# EAGLE design rpi2caster (EAGLE 7.3.0)
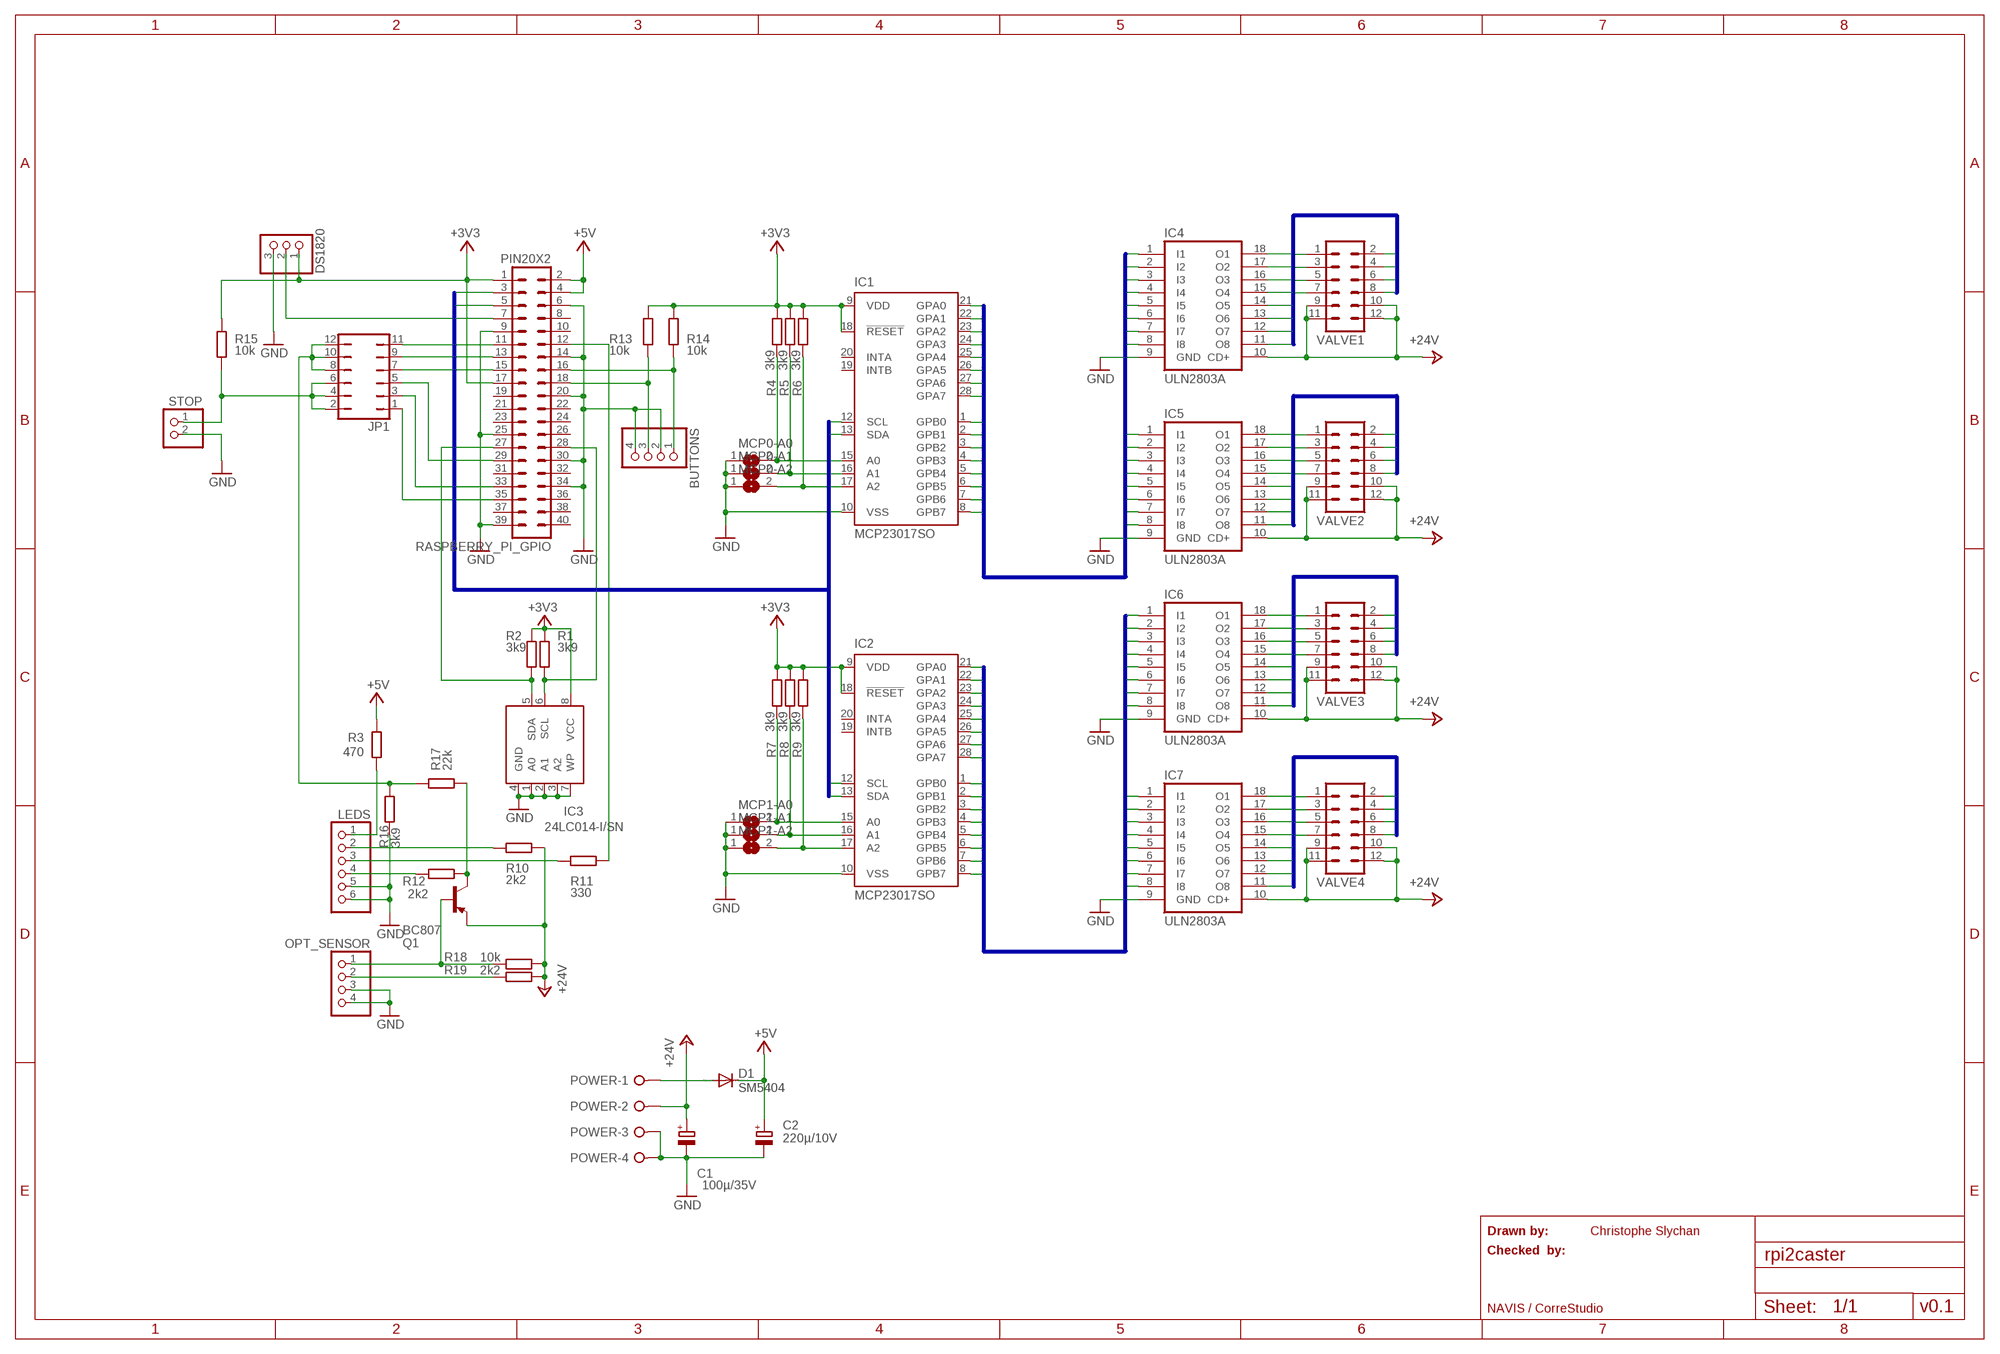
[diagram p0: schematic, sheet 1]

## Parts
BUTTONS  PINHD-1X4  [1X04]
C1  100µ/35V  CPOL-EUE5-6  [E5-6]
C2  220µ/10V  CPOL-EUE2.5-7  [E2,5-7]
D1  SM5404  DIODE-MELF-MLL41  [MELF-MLL41]
DS1820  PINHD-1X3  [1X03]
IC1  MCP23017SO  [SO28W]
IC2  MCP23017SO  [SO28W]
IC3  24LC014-I/SN  EEPROM24  [SOIC8]
IC4  ULN2803A  ULN2803A-SMD  [SO18W]
IC5  ULN2803A  ULN2803A-SMD  [SO18W]
IC6  ULN2803A  ULN2803A-SMD  [SO18W]
IC7  ULN2803A  ULN2803A-SMD  [SO18W]
JP1  JP6Q  [JP6Q]
LEDS  PINHD-1X6  [1X06]
MCP0-A0  SJ  [SJ]
MCP0-A1  SJ  [SJ]
MCP0-A2  SJ  [SJ]
MCP1-A0  SJ  [SJ]
MCP1-A1  SJ  [SJ]
MCP1-A2  SJ  [SJ]
OPT_SENSOR  PINHD-1X4  [1X04]
POWER  W237-04P  [W237-4P]
Q1  BC807  BC807-16SMD  [SOT23-BEC]
R1  3k9  R-EU_M0805  [M0805]
R2  3k9  R-EU_M0805  [M0805]
R3  470  R-EU_M0805  [M0805]
R4  3k9  R-EU_M0805  [M0805]
R5  3k9  R-EU_M0805  [M0805]
R6  3k9  R-EU_M0805  [M0805]
R7  3k9  R-EU_M0805  [M0805]
R8  3k9  R-EU_M0805  [M0805]
R9  3k9  R-EU_M0805  [M0805]
R10  2k2  R-EU_M0805  [M0805]
R11  330  R-EU_M0805  [M0805]
R12  2k2  R-EU_M0805  [M0805]
R13  10k  R-EU_M0805  [M0805]
R14  10k  R-EU_M0805  [M0805]
R15  10k  R-EU_M0805  [M0805]
R16  3k9  R-EU_M0805  [M0805]
R17  22k  R-EU_M0805  [M0805]
R18  10k  R-EU_M0805  [M0805]
R19  2k2  R-EU_M0805  [M0805]
RASPBERRY_PI_GPIO  PIN20X2  [PIN_20X2]
STOP  PINHD-1X2  [1X02]
VALVE1  MA06-2  [MA06-2]
VALVE2  MA06-2  [MA06-2]
VALVE3  MA06-2  [MA06-2]
VALVE4  MA06-2  [MA06-2]

## Nets
+3V3: DS1820.1 IC1.9(VDD) IC1.18(!RESET) IC2.9(VDD) IC2.18(!RESET) IC3.8(VCC) R1.1 R2.1 R4.2 R5.2 R6.2 R7.2 R8.2 R9.2 R13.2 R14.2 R15.2 RASPBERRY_PI_GPIO.1 RASPBERRY_PI_GPIO.17
+5V: C2.+ D1.C R3.2 RASPBERRY_PI_GPIO.2 RASPBERRY_PI_GPIO.4
+24V: C1.+ IC4.10(CD+) IC5.10(CD+) IC6.10(CD+) IC7.10(CD+) POWER.2 Q1.E R10.2 R18.1 R19.1 VALVE1.9 VALVE1.10 VALVE1.11 VALVE1.12 VALVE2.9 VALVE2.10 VALVE2.11 VALVE2.12 VALVE3.9 VALVE3.10 VALVE3.11 VALVE3.12 VALVE4.9 VALVE4.10 VALVE4.11 VALVE4.12
GND: BUTTONS.2 BUTTONS.4 C1.- C2.- DS1820.3 IC1.10(VSS) IC2.10(VSS) IC3.1(A0) IC3.2(A1) IC3.3(A2) IC3.4(GND) IC3.7(WP) IC4.9(GND) IC5.9(GND) IC6.9(GND) IC7.9(GND) LEDS.5 LEDS.6 MCP0-A0.1 MCP0-A1.1 MCP0-A2.1 MCP1-A0.1 MCP1-A1.1 MCP1-A2.1 OPT_SENSOR.3 OPT_SENSOR.4 POWER.3 POWER.4 R16.1 RASPBERRY_PI_GPIO.6 RASPBERRY_PI_GPIO.9 RASPBERRY_PI_GPIO.14 RASPBERRY_PI_GPIO.20 RASPBERRY_PI_GPIO.25 RASPBERRY_PI_GPIO.30 RASPBERRY_PI_GPIO.34 RASPBERRY_PI_GPIO.39 STOP.2
I2C0: IC1.13(SDA) IC2.13(SDA) RASPBERRY_PI_GPIO.3
I2C1: IC1.12(SCL) IC2.12(SCL) RASPBERRY_PI_GPIO.5
MCP0_OUT0: IC1.21(GPA0) IC4.8(I8)
MCP0_OUT1: IC1.22(GPA1) IC4.7(I7)
MCP0_OUT2: IC1.23(GPA2) IC4.6(I6)
MCP0_OUT3: IC1.24(GPA3) IC4.5(I5)
MCP0_OUT4: IC1.25(GPA4) IC4.4(I4)
MCP0_OUT5: IC1.26(GPA5) IC4.3(I3)
MCP0_OUT6: IC1.27(GPA6) IC4.2(I2)
MCP0_OUT7: IC1.28(GPA7) IC4.1(I1)
MCP0_OUT8: IC1.1(GPB0) IC5.8(I8)
MCP0_OUT9: IC1.2(GPB1) IC5.7(I7)
MCP0_OUT10: IC1.3(GPB2) IC5.6(I6)
MCP0_OUT11: IC1.4(GPB3) IC5.5(I5)
MCP0_OUT12: IC1.5(GPB4) IC5.4(I4)
MCP0_OUT13: IC1.6(GPB5) IC5.3(I3)
MCP0_OUT14: IC1.7(GPB6) IC5.2(I2)
MCP0_OUT15: IC1.8(GPB7) IC5.1(I1)
MCP1_OUT0: IC2.21(GPA0) IC6.8(I8)
MCP1_OUT1: IC2.22(GPA1) IC6.7(I7)
MCP1_OUT2: IC2.23(GPA2) IC6.6(I6)
MCP1_OUT3: IC2.24(GPA3) IC6.5(I5)
MCP1_OUT4: IC2.25(GPA4) IC6.4(I4)
MCP1_OUT5: IC2.26(GPA5) IC6.3(I3)
MCP1_OUT6: IC2.27(GPA6) IC6.2(I2)
MCP1_OUT7: IC2.28(GPA7) IC6.1(I1)
MCP1_OUT8: IC2.1(GPB0) IC7.8(I8)
MCP1_OUT9: IC2.2(GPB1) IC7.7(I7)
MCP1_OUT10: IC2.3(GPB2) IC7.6(I6)
MCP1_OUT11: IC2.4(GPB3) IC7.5(I5)
MCP1_OUT12: IC2.5(GPB4) IC7.4(I4)
MCP1_OUT13: IC2.6(GPB5) IC7.3(I3)
MCP1_OUT14: IC2.7(GPB6) IC7.2(I2)
MCP1_OUT15: IC2.8(GPB7) IC7.1(I1)
N$1: LEDS.1 R3.1
N$2: IC3.5(SDA) R2.2 RASPBERRY_PI_GPIO.27
N$3: IC3.6(SCL) R1.2 RASPBERRY_PI_GPIO.28
N$4: OPT_SENSOR.2 R19.2
N$5: DS1820.2 RASPBERRY_PI_GPIO.7
N$6: IC1.15(A0) MCP0-A0.2 R4.1
N$7: IC1.16(A1) MCP0-A1.2 R5.1
N$8: IC1.17(A2) MCP0-A2.2 R6.1
N$9: IC2.15(A0) MCP1-A0.2 R7.1
N$10: IC2.16(A1) MCP1-A1.2 R8.1
N$11: IC2.17(A2) MCP1-A2.2 R9.1
N$12: LEDS.2 R10.1
N$13: LEDS.3 R11.1
N$14: LEDS.4 R12.1
N$15: JP1.11 RASPBERRY_PI_GPIO.11
N$16: JP1.9 RASPBERRY_PI_GPIO.13
N$17: R11.2 RASPBERRY_PI_GPIO.12
N$18: BUTTONS.1 R14.1 RASPBERRY_PI_GPIO.16
N$19: BUTTONS.3 R13.1 RASPBERRY_PI_GPIO.18
N$20: JP1.2 JP1.4 JP1.6 R15.1 STOP.1
N$21: JP1.8 JP1.10 JP1.12 R16.2 R17.2
N$22: OPT_SENSOR.1 Q1.B R18.2
N$23: Q1.C R12.2 R17.1
N$24: JP1.7 RASPBERRY_PI_GPIO.15
N$25: JP1.5 RASPBERRY_PI_GPIO.29
N$26: JP1.3 RASPBERRY_PI_GPIO.33
N$27: JP1.1 RASPBERRY_PI_GPIO.35
N$29: D1.A POWER.1
VALVE1_1: IC4.11(O8) VALVE1.1
VALVE1_2: IC4.12(O7) VALVE1.2
VALVE1_3: IC4.13(O6) VALVE1.3
VALVE1_4: IC4.14(O5) VALVE1.4
VALVE1_5: IC4.15(O4) VALVE1.5
VALVE1_6: IC4.16(O3) VALVE1.6
VALVE1_7: IC4.17(O2) VALVE1.7
VALVE1_8: IC4.18(O1) VALVE1.8
VALVE2_1: IC5.18(O1) VALVE2.1
VALVE2_2: IC5.17(O2) VALVE2.2
VALVE2_3: IC5.16(O3) VALVE2.3
VALVE2_4: IC5.15(O4) VALVE2.4
VALVE2_5: IC5.14(O5) VALVE2.5
VALVE2_6: IC5.13(O6) VALVE2.6
VALVE2_7: IC5.12(O7) VALVE2.7
VALVE2_8: IC5.11(O8) VALVE2.8
VALVE3_1: IC6.18(O1) VALVE3.1
VALVE3_2: IC6.17(O2) VALVE3.2
VALVE3_3: IC6.16(O3) VALVE3.3
VALVE3_4: IC6.15(O4) VALVE3.4
VALVE3_5: IC6.14(O5) VALVE3.5
VALVE3_6: IC6.13(O6) VALVE3.6
VALVE3_7: IC6.12(O7) VALVE3.7
VALVE3_8: IC6.11(O8) VALVE3.8
VALVE4_1: IC7.11(O8) VALVE4.1
VALVE4_2: IC7.12(O7) VALVE4.2
VALVE4_3: IC7.13(O6) VALVE4.3
VALVE4_4: IC7.14(O5) VALVE4.4
VALVE4_5: IC7.15(O4) VALVE4.5
VALVE4_6: IC7.16(O3) VALVE4.6
VALVE4_7: IC7.17(O2) VALVE4.7
VALVE4_8: IC7.18(O1) VALVE4.8
Unconnected: IC1.19(INTB) IC1.20(INTA) IC2.19(INTB) IC2.20(INTA) RASPBERRY_PI_GPIO.8 RASPBERRY_PI_GPIO.10 RASPBERRY_PI_GPIO.19 RASPBERRY_PI_GPIO.21 RASPBERRY_PI_GPIO.22 RASPBERRY_PI_GPIO.23 RASPBERRY_PI_GPIO.24 RASPBERRY_PI_GPIO.26 RASPBERRY_PI_GPIO.31 RASPBERRY_PI_GPIO.32 RASPBERRY_PI_GPIO.36 RASPBERRY_PI_GPIO.37 RASPBERRY_PI_GPIO.38 RASPBERRY_PI_GPIO.40

## Buses
MCP0_OUT[0..15]
MCP1_OUT[0..15]
I2C[0..1]
VALVE1_[1..8]
VALVE2_[1..8]
VALVE3_[1..8]
VALVE4_[1..8]

## Notes on the sheet
- Drawn by: | Christophe Slychan
- Checked  by:
- NAVIS / CorreStudio | v0.1

## Library data of the parts
BUTTONS OPT_SENSOR = pinhead:PINHD-1X4: PIN HEADER
C1 C2 = rcl:CPOL-EU: POLARIZED CAPACITOR, European symbol
D1 = diode:DIODE-: DIODE
DS1820 = pinhead:PINHD-1X3: PIN HEADER
IC1 IC2 = microchip:MCP23017: http://ww1.microchip.com/downloads/en/DeviceDoc/21952a.pdf Source: http://ww1.microchip.com/downloads/en/DeviceDoc/21952a.pdf; MF: MICROCHIP; MPN: MCP23017-E/SO; OC_FARNELL: 1332087; OC_NEWARK: 31K2958
IC3 = FLYFISH:EEPROM24
IC4-IC7 = uln-udn:ULN2803A-SMD
JP1 = jumper:JP6Q: JUMPER
LEDS = pinhead:PINHD-1X6: PIN HEADER
MCP0-A0 MCP0-A1 MCP0-A2 MCP1-A0 MCP1-A1 MCP1-A2 = jumper:SJ: SMD solder JUMPER
POWER = con-wago-508:W237-04P: WAGO SREW CLAMP; OC_FARNELL: unknown; OC_NEWARK: unknown
Q1 = transistor-pnp:BC807*: PNP Transistror
R1-R19 = resistor:R-EU_: RESISTOR, European symbol; TOLERANCE: 5%
RASPBERRY_PI_GPIO = FLYFISH:PIN20X2
STOP = pinhead:PINHD-1X2: PIN HEADER
VALVE1-VALVE4 = con-lstb:MA06-2: PIN HEADER; OC_FARNELL: unknown; OC_NEWARK: unknown

## Board
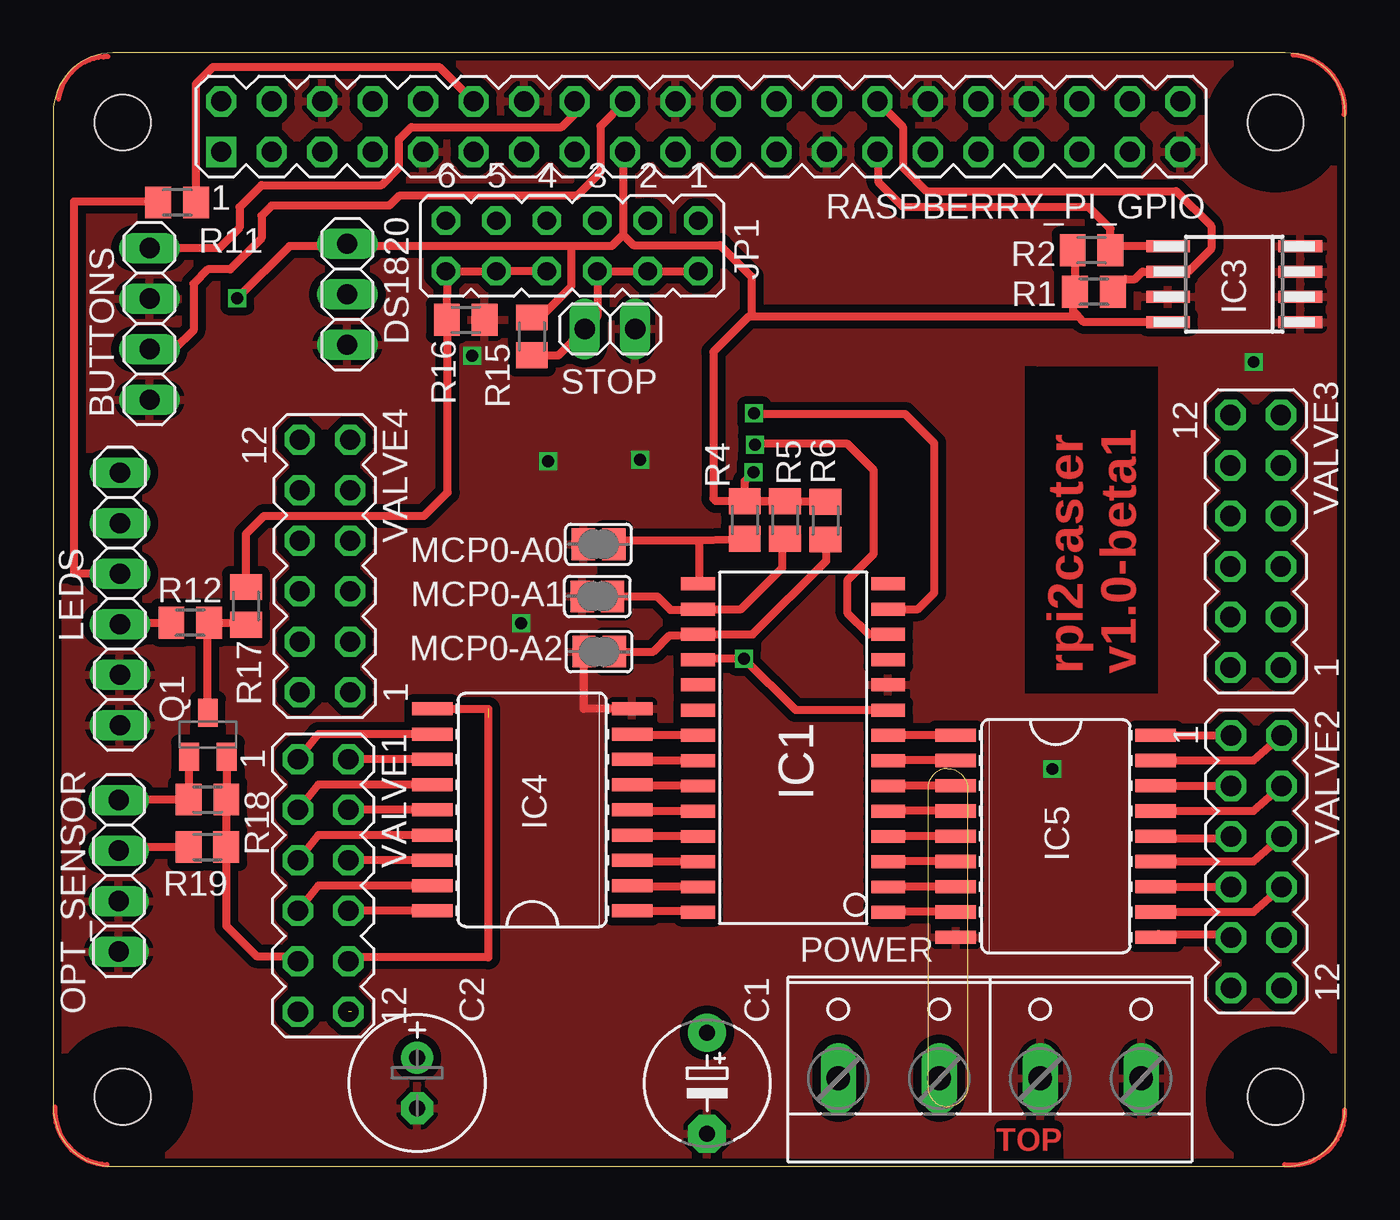
[diagram p1: board, top side]
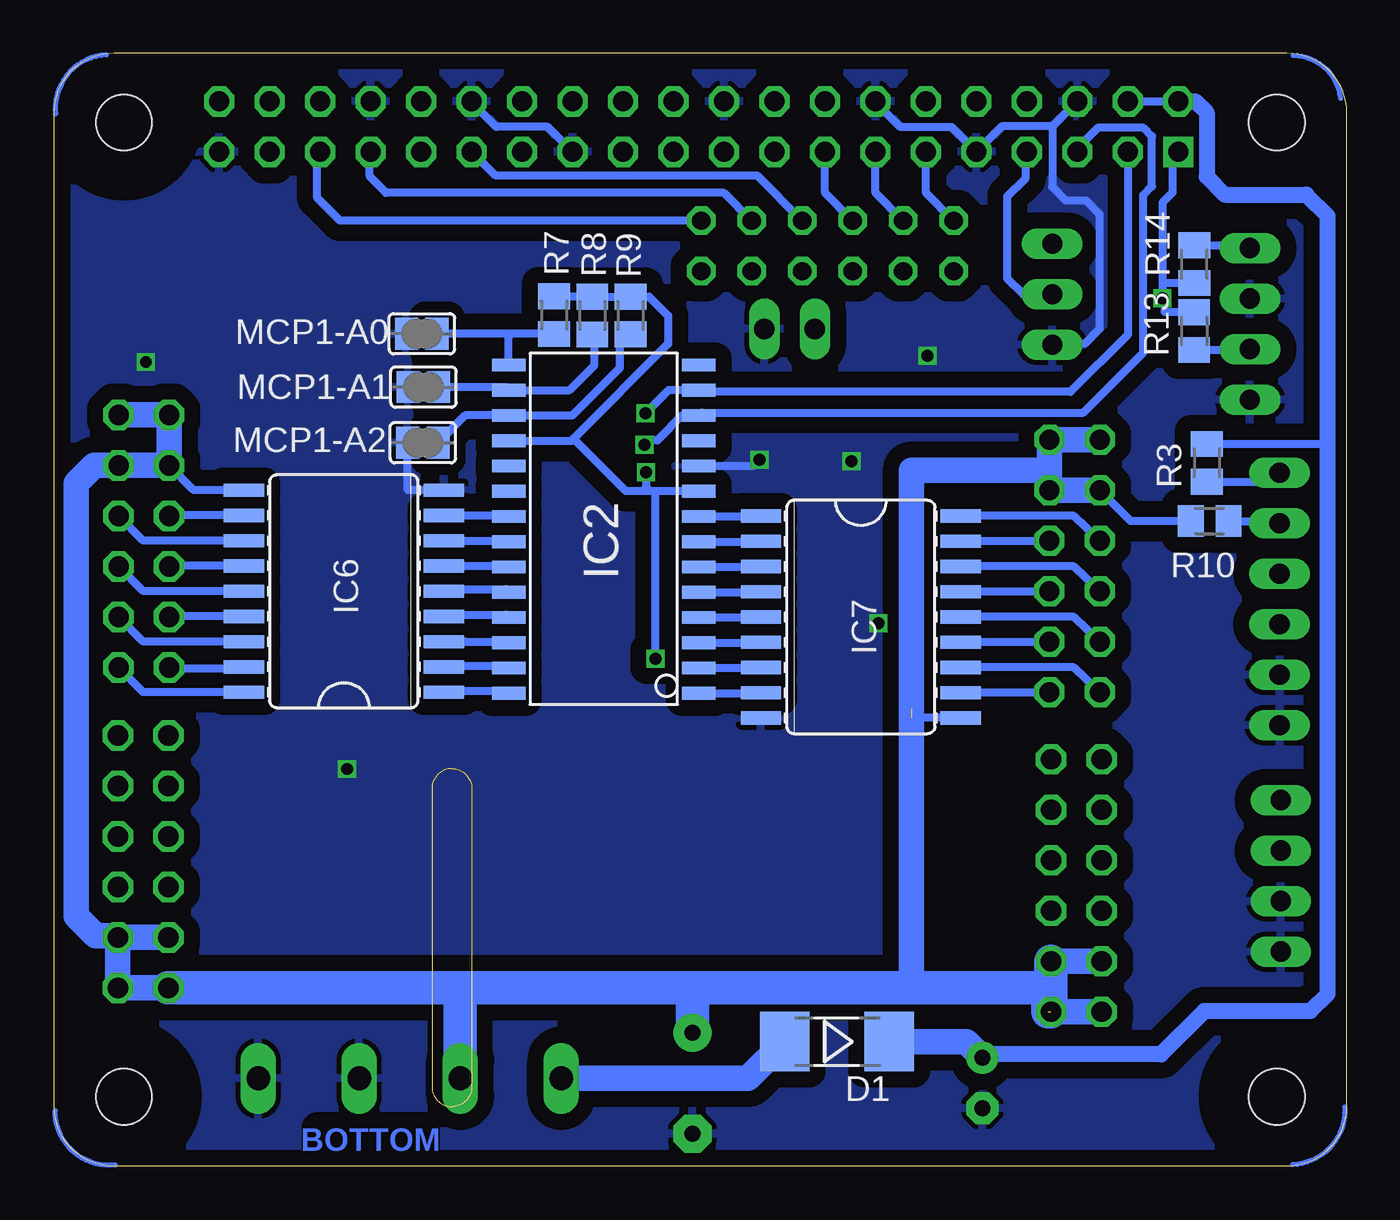
[diagram p2: board, bottom side, seen from below]

Size 65 x 56 mm. Coordinates in mm from the lower left corner, seen from the top.
Outline: 0,3 arc90 3,0 62,0 arc90 65,3 65,53 arc90 62,56 3,56 arc90 0,53 0,3
Copper layers (1*16): Top 0.035mm / dielectric 1.5mm / Bottom 0.035mm
Design rules "ITEADstudio_DRC *": minimum track width 6mil, minimum drill 12mil, track to track 10mil, track to pad 8mil, pad to pad 10mil, via to via 10mil, smd to smd 0mil, copper to edge 16mil, drill to drill 10mil, minimum pad ring 10mil, minimum via ring 6mil, stop-mask expansion 2mil, vias tented up to drill 100mil, thermal gap 10mil
Holes 2.8 mm at 3.5,3.5 3.5,52.5 61.5,52.5 61.5,3.5
tRestrict: area 1.9,51 to 5,54; area 60,51 to 63,54; area 60,1.9 to 63,5; area 1.9,1.9 to 5,5
bRestrict: area 1.9,1.9 to 5,5; area 1.9,51 to 5,54; area 60,1.9 to 63,5; area 60,51 to 63,54
Milling: 6 lines

### Footprints (pad centres in the part's own frame; a part is rotated, then mirrored left to right if it is on the bottom)
1X04 = drill 1.016 long: 1 -3.81,0; 2 -1.27,0; 3 1.27,0; 4 3.81,0
E5-6 = drill 0.813 pad 1.905: + -2.54,0 | drill 0.813 pad 1.905 octagon: - 2.54,0
E2,5-7 = drill 0.813 pad 1.6: + -1.27,0 | drill 0.813 pad 1.6 octagon: - 1.27,0
MELF-MLL41 = smd 2.5 x 3: A 2.625,0; C -2.625,0
1X03 = drill 1.016 long: 1 -2.54,0; 2 0,0; 3 2.54,0
SO28W = smd 0.65 x 1.7: 1 -7.62,-4.78; 2 -6.35,-4.78; 3 -5.08,-4.78; 4 -3.81,-4.78; 5 -2.54,-4.78; 6 -1.27,-4.78; 7 0,-4.78; 8 1.27,-4.78; 9 2.54,-4.78; 10 3.81,-4.78; 11 5.08,-4.78; 12 6.35,-4.78; 13 7.62,-4.78; 14 8.89,-4.78; 15 8.89,4.78; 16 7.62,4.78; 17 6.35,4.78; 18 5.08,4.78; 19 3.81,4.78; 20 2.54,4.78; 21 1.27,4.78; 22 0,4.78; 23 -1.27,4.78; 24 -2.54,4.78; 25 -3.81,4.78; 26 -5.08,4.78; 27 -6.35,4.78; 28 -7.62,4.78
SOIC8 = smd 0.6 x 2.2: 1 -1.905,-3.33; 2 -0.635,-3.33; 3 0.635,-3.33; 4 1.905,-3.33; 5 1.905,3.33; 6 0.635,3.33; 7 -0.635,3.33; 8 -1.905,3.33
SO18W = smd 0.66 x 2.032: 1 -5.08,-5.029; 2 -3.81,-5.029; 3 -2.54,-5.029; 4 -1.27,-5.029; 5 0,-5.029; 6 1.27,-5.029; 7 2.54,-5.029; 8 3.81,-5.029; 9 5.08,-5.029; 10 5.08,5.029; 11 3.81,5.029; 12 2.54,5.029; 13 1.27,5.029; 14 0,5.029; 15 -1.27,5.029; 16 -2.54,5.029; 17 -3.81,5.029; 18 -5.08,5.029
JP6Q = drill 0.914 octagon: 1 -6.35,-1.27; 2 -6.35,1.27; 3 -3.81,-1.27; 4 -3.81,1.27; 5 -1.27,-1.27; 6 -1.27,1.27; 7 1.27,-1.27; 8 1.27,1.27; 9 3.81,-1.27; 10 3.81,1.27; 11 6.35,-1.27; 12 6.35,1.27
1X06 = drill 1.016 long: 1 -6.35,0; 2 -3.81,0; 3 -1.27,0; 4 1.27,0; 5 3.81,0; 6 6.35,0
SJ = smd 1.168 x 1.6: 1 -0.762,0; 2 0.762,0
W237-4P = drill 1.194 long: 1 -7.62,-0.635; 2 -2.54,-0.635; 3 2.54,-0.635; 4 7.62,-0.635
SOT23-BEC = smd 1 x 1.4: B -0.95,-1.1; C 0,1.1; E 0.95,-1.1
M0805 = smd 1.3 x 1.6: 1 -0.95,0; 2 0.95,0
PIN_20X2 = drill 1.016 square: 1 -24.13,-1.27 | drill 1.016 octagon: 2 -24.13,1.27; 3 -21.59,-1.27; 4 -21.59,1.27; 5 -19.05,-1.27; 6 -19.05,1.27; 7 -16.51,-1.27; 8 -16.51,1.27; 9 -13.97,-1.27; 10 -13.97,1.27; 11 -11.43,-1.27; 12 -11.43,1.27; 13 -8.89,-1.27; 14 -8.89,1.27; 15 -6.35,-1.27; 16 -6.35,1.27; 17 -3.81,-1.27; 18 -3.81,1.27; 19 -1.27,-1.27; 20 -1.27,1.27; 21 1.27,-1.27; 22 1.27,1.27; 23 3.81,-1.27; 24 3.81,1.27; 25 6.35,-1.27; 26 6.35,1.27; 27 8.89,-1.27; 28 8.89,1.27; 29 11.43,-1.27; 30 11.43,1.27; 31 13.97,-1.27; 32 13.97,1.27; 33 16.51,-1.27; 34 16.51,1.27; 35 19.05,-1.27; 36 19.05,1.27; 37 21.59,-1.27; 38 21.59,1.27; 39 24.13,-1.27; 40 24.13,1.27
1X02 = drill 1.016 long: 1 -1.27,0; 2 1.27,0
MA06-2 = drill 1.016 octagon: 1 -6.35,-1.27; 2 -6.35,1.27; 3 -3.81,-1.27; 4 -3.81,1.27; 5 -1.27,-1.27; 6 -1.27,1.27; 7 1.27,-1.27; 8 1.27,1.27; 9 3.81,-1.27; 10 3.81,1.27; 11 6.35,-1.27; 12 6.35,1.27

### Placement (x,y rotation side)
BUTTONS  4.85,42.37 270 top
C1  32.9,4.17 270 top
C2  18.31,4.19 270 top
D1  25.62,6.27 180 bottom
DS1820  14.79,43.85 270 top
IC1  37.23,20.4 90 top
IC2  37.36,31.41 90 bottom
IC3  59.42,44.36 90 top
IC4  24.1,17.93 90 top
IC5  50.44,16.6 270 top
IC6  50.43,28.92 90 bottom
IC7  24.42,27.63 270 bottom
JP1  26.11,46.29 180 top
LEDS  3.36,28.53 270 top
MCP0-A0  27.44,31.28 0 top
MCP0-A1  27.38,28.66 0 top
MCP0-A2  27.47,25.89 0 top
MCP1-A0  46.51,41.87 0 bottom
MCP1-A1  46.43,39.19 0 bottom
MCP1-A2  46.46,36.39 0 bottom
OPT_SENSOR  3.3,14.61 270 top
POWER  47.12,5.06 0 top
Q1  7.78,21.7 0 top
R1  52.36,43.98 0 top
R2  52.24,46.07 0 top
R3  7.02,35.38 90 bottom
R4  34.8,32.51 90 top
R5  36.82,32.5 90 top
R6  38.85,32.48 90 top
R7  39.85,42.81 90 bottom
R8  37.94,42.79 90 bottom
R9  36.01,42.79 90 bottom
R10  6.87,32.45 180 bottom
R11  6.24,48.47 0 top
R12  6.89,27.34 0 top
R13  7.66,42.01 90 bottom
R14  7.64,45.37 270 bottom
R15  24.08,41.74 90 top
R16  20.76,42.57 180 top
R17  9.7,28.18 90 top
R18  7.77,18.44 180 top
R19  7.76,16.05 180 top
RASPBERRY_PI_GPIO  32.58,52.29 0 top
STOP  28.01,42.11 0 top
VALVE1  13.58,14.12 270 top
VALVE2  60.53,15.32 270 top
VALVE3  60.5,31.44 90 top
VALVE4  13.66,30.19 90 top

### Tracks (layer width: path | path; a pad name or v marks a point on that pad's centre or on a via)
+3V3  (via drill 0.6)
  Top 0.406: R5.2 R4.2 34.8,34.47 v35.24,34.91 | R5.2 38.82,33.45 R6.2 | 32.46,25.46 IC1.18 32.51,25.54 v34.76,25.54 37.36,22.94 IC1.9 | R2.1 51.41,45.95 R1.1 51.33,43.9 51.33,42.99 51.57,42.74 | RASPBERRY_PI_GPIO.17 28.67,50.92 28.67,46.85 | 28.67,46.85 28.1,46.28 26.01,46.28 | IC3.8 51.86,42.46 51.57,42.74 | 35.14,42.74 35,42.74 33.21,40.96 33.21,33.58 33.33,33.45 R5.2 | 35.14,42.74 51.57,42.74 | 26.01,46.28 14.79,46.28 | 14.79,46.28 DS1820.1 | 14.79,46.28 11.89,46.28 v9.26,43.66 | 28.67,46.85 29.18,46.33 33.56,46.33 35.14,44.75 35.14,42.74 | R15.2 24.49,42.69 26.07,44.27 26.07,46.22 26.01,46.28
  Bottom 0.406: R7.2 37.96,43.76 R8.2 R9.2 35.07,43.74 34.12,42.79 34.12,41.36 38.88,36.59 | 38.88,36.59 39,36.48 42.12,36.48 IC2.18 | IC2.9 34.77,33.95 | 34.77,33.95 35.03,33.95 | 35.03,33.95 36.24,33.95 38.88,36.59 | 9.24,44.41 9.24,48.48 8.73,48.99 8.73,50.73 RASPBERRY_PI_GPIO.1 | 28.77,51.07 RASPBERRY_PI_GPIO.17 | R13.2 9.13,42.95 9.13,43.53 v9.26,43.66 9.24,43.69 9.24,44.41 | R14.2 9.22,44.42 9.24,44.41 | v35.24,34.91 35.24,34.16 35.03,33.95 | v34.76,25.54 34.76,33.94 34.77,33.95
+5V
  Bottom 0.406: RASPBERRY_PI_GPIO.4 RASPBERRY_PI_GPIO.2 | R3.2 1.07,36.33 0.94,36.46
  Bottom 0.813: RASPBERRY_PI_GPIO.2 7.58,53.56 7.03,53.01 7.03,49.79 6.11,48.87 2.01,48.87 0.94,47.8 0.94,36.46 0.94,8.66 1.79,7.81 1.79,7.8 7.15,7.8 9.33,5.63 18.14,5.63 C2.+
  Bottom 1.27: D1.C 19.12,6.27 C2.+
+24V  (2 unrouted)
  Top 0.406: IC5.10 55.63,11.67 59.26,11.67 VALVE2.9 | R19.1 | R19.1 8.71,12.09 10.23,10.57 12.3,10.57 VALVE1.9 | IC4.10 21.89,23.01 21.89,10.51 14.85,10.51 VALVE1.10 | Q1.E 8.72,20.6 R18.1 8.71,18.44 R19.1
  Bottom 0.406: IC6.10 57.99,34 VALVE3.10 | R10.2 10.84,32.45 VALVE4.10 | IC7.10 21.89,22.55
  Bottom 1.27: VALVE3.11 VALVE3.12 VALVE3.10 VALVE3.9 62.99,35.25 63.9,34.34 63.9,12.58 62.91,11.59 61.89,11.59 VALVE2.10 | VALVE2.10 VALVE2.9 | VALVE2.10 VALVE2.12 VALVE2.11 | 15.01,10.31 VALVE1.10 VALVE1.9 | 14.93,35.01 VALVE4.9 VALVE4.10 | 14.93,35.01 21.89,35.01 21.89,22.55 21.89,8.96 | VALVE4.12 VALVE4.11 14.93,35.01 | VALVE1.11 VALVE1.12
  Bottom 1.676: VALVE2.11 44.58,8.97 | 44.58,8.97 POWER.2 | 44.58,8.97 32.9,8.97 | 32.9,8.97 C1.+ | 15.01,7.77 15.01,8.97 32.9,8.97 | VALVE1.10 VALVE1.12
GND  (via drill 0.6)
  Top 0.406: IC4.9 26.7,23.01 MCP0-A2.1
  Bottom 0.406: 14.79,52.3 RASPBERRY_PI_GPIO.6 | 14.79,52.3 17.33,52.3 RASPBERRY_PI_GPIO.9 19.85,52.26 22.43,52.26 23.69,53.52 RASPBERRY_PI_GPIO.14 | RASPBERRY_PI_GPIO.25 40.19,52.27 42.77,52.27 44.01,53.52 RASPBERRY_PI_GPIO.30 | IC2.10 29.82,35.22 v29.51,35.52 | IC6.9 47.22,34 MCP1-A2.1 | 14.79,52.3 14.79,49.25 14.13,48.59 13.11,48.59 12.41,47.88 12.41,42.12 13.16,41.38 14.73,41.38 DS1820.3
  other vias: 24.89,35.46 23.54,27.32 50.28,19.98 60.39,40.45 21.07,40.77
  pour Bottom (isolate 0.813): 0,3 arc90 3,0 62,0 arc90 65,3 65,53 arc90 62,56 3,56 arc90 0,53
  pour Top (isolate 0.406): 0,3 arc90 3,0 62,0 arc90 65,3 65,53 arc90 62,56 3,56 arc90 0,53
I2C0  (via drill 0.6)
  Top 0.406: IC1.13 43.51,28.02 44.33,28.84 44.33,36.37 42.88,37.83 35.3,37.83 v35.26,37.87
  Bottom 0.406: RASPBERRY_PI_GPIO.3 10.99,41.83 13.87,38.95 32.49,38.95 IC2.13 34.1,39.03 v35.26,37.87
I2C1  (via drill 0.6)
  Top 0.406: IC1.12 41.03,26.75 39.97,27.81 39.97,29.48 41.29,30.81 41.29,35 39.97,36.33 35.34,36.33 v35.3,36.29
  Bottom 0.406: v35.3,36.29 35.07,36.52 34.66,36.52 33.42,37.76 IC2.12 32.43,37.91 13.22,37.91 10.22,40.91 10.22,48.84 9.77,49.28 9.77,51.81 10.19,52.23 12.51,52.23 13.53,51.2 RASPBERRY_PI_GPIO.5
MCP0_OUT0
  Top 0.406: IC1.21 29.2,21.67 IC4.8
MCP0_OUT1
  Top 0.406: IC1.22 29.2,20.4 IC4.7
MCP0_OUT2
  Top 0.406: IC1.23 29.2,19.13 IC4.6
MCP0_OUT3
  Top 0.406: IC1.24 29.2,17.86 IC4.5
MCP0_OUT4
  Top 0.406: IC1.25 29.2,16.59 IC4.4
MCP0_OUT5
  Top 0.406: IC1.26 29.2,15.32 IC4.3
MCP0_OUT6
  Top 0.406: IC1.27 29.2,14.05 IC4.2
MCP0_OUT7
  Top 0.406: IC4.1 32.38,12.85 IC1.28
MCP0_OUT8
  Top 0.406: IC5.8 IC1.1
MCP0_OUT9
  Top 0.406: IC5.7 IC1.2
MCP0_OUT10
  Top 0.406: IC5.6 IC1.3
MCP0_OUT11
  Top 0.406: IC5.5 IC1.4
MCP0_OUT12
  Top 0.406: IC5.4 IC1.5
MCP0_OUT13
  Top 0.406: IC5.3 IC1.6
MCP0_OUT14
  Top 0.406: IC5.2 IC1.7
MCP0_OUT15
  Top 0.406: IC5.1 IC1.8
MCP1_OUT0
  Bottom 0.406: IC6.8 42.19,32.73 IC2.21
MCP1_OUT1
  Bottom 0.406: IC6.7 42.19,31.46 IC2.22
MCP1_OUT2
  Bottom 0.406: IC6.6 42.19,30.19 IC2.23
MCP1_OUT3
  Bottom 0.406: IC6.5 45.27,28.92 45.17,29.02 42.29,29.02 IC2.24
MCP1_OUT4
  Bottom 0.406: IC6.4 45.11,27.65 45.03,27.74 42.27,27.74 IC2.25
MCP1_OUT5
  Bottom 0.406: IC6.3 44.31,26.38 42.19,26.38 IC2.26
MCP1_OUT6
  Bottom 0.406: IC6.2 45.4,25.15 45.38,25.17 42.25,25.17 IC2.27
MCP1_OUT7
  Bottom 0.406: IC6.1 45.31,23.92 42.27,23.92 IC2.28
MCP1_OUT8
  Bottom 0.406: IC2.1 29.48,23.79 IC7.8
MCP1_OUT9
  Bottom 0.406: IC2.2 29.48,25.06 IC7.7
MCP1_OUT10
  Bottom 0.406: IC2.3 29.48,26.33 IC7.6
MCP1_OUT11
  Bottom 0.406: IC2.4 29.48,27.6 IC7.5
MCP1_OUT12
  Bottom 0.406: IC2.5 29.48,28.87 IC7.4
MCP1_OUT13
  Bottom 0.406: IC2.6 29.48,30.14 IC7.3
MCP1_OUT14
  Bottom 0.406: IC2.7 29.48,31.41 IC7.2
MCP1_OUT15
  Bottom 0.406: IC2.8 29.48,32.68 IC7.1
N$1
  Bottom 0.406: R3.1 3.81,34.43 LEDS.1
N$2
  Top 0.406: IC3.5 53.19,46.27 R2.2 53.19,47.16 52.11,48.24 42.78,48.24 41.53,49.49 41.53,50.96 RASPBERRY_PI_GPIO.27
N$3
  Top 0.406: R1.2 53.95,44.62 54.42,44.62 54.8,45 IC3.6 57.12,45 58.26,46.13 58.26,47.29 56.5,49.05 43.94,49.05 42.75,50.23 42.75,52.28 RASPBERRY_PI_GPIO.28
N$4
  Top 0.406: R19.2 3.3,16.05 OPT_SENSOR.2
N$5
  Bottom 0.406: DS1820.2 16.25,43.85 17.05,44.65 17.05,48.78 16.13,49.7 16.13,50.96 RASPBERRY_PI_GPIO.7
N$6
  Top 0.406: MCP0-A0.2 28.41,31.48 32.51,31.48 | 32.51,31.48 R4.1 | IC1.15 32.51,29.35 32.51,31.48
N$7
  Top 0.406: MCP0-A1.2 30.38,28.66 31.05,27.99 32.42,27.99 IC1.16 34.61,28.02 36.68,30.09 36.68,31.41 R5.1
N$8
  Top 0.406: MCP0-A2.2 30.2,25.89 31.02,26.7 32.41,26.7 IC1.17 35.19,26.75 38.89,30.45 38.89,31.48 R6.1
N$9
  Bottom 0.406: R7.1 42.28,41.86 | 42.28,41.86 45.74,41.86 MCP1-A0.2 | IC2.15 42.14,41.72 42.28,41.86
N$10
  Bottom 0.406: MCP1-A1.2 42.3,39.19 IC2.16 39.08,39.03 37.83,40.28 37.83,41.73 R8.1
N$11
  Bottom 0.406: MCP1-A2.2 44.33,37.76 IC2.17 38.94,37.76 36.55,40.15 36.55,41.3 R9.1
N$12
  Bottom 0.406: R10.1 3.46,32.45 LEDS.2
N$13
  Top 0.406: LEDS.3 1.05,29.8 1.05,48.53 5.29,48.53 R11.1
N$14
  Top 0.406: LEDS.4 3.44,27.34 R12.1
N$15
  Bottom 0.406: JP1.11 21.15,48.95 RASPBERRY_PI_GPIO.11
N$16
  Bottom 0.406: JP1.9 23.69,48.95 RASPBERRY_PI_GPIO.13
N$17
  Top 0.406: R11.2 7.19,54.44 8.04,55.3 19.41,55.3 RASPBERRY_PI_GPIO.12
N$18
  Top 0.406: RASPBERRY_PI_GPIO.16 26.25,53.54 26.25,52.95 25.57,52.27 18.01,52.27 17.4,51.66 17.4,50.24 16.51,49.35 10.48,49.35 9.38,48.24 9.38,47.21 8.35,46.18 BUTTONS.1
  Bottom 0.406: R14.1 4.99,46.32 BUTTONS.1
N$19
  Top 0.406: RASPBERRY_PI_GPIO.18 27.53,52.32 27.53,49.99 26.35,48.81 17.4,48.81 16.9,48.31 10.98,48.31 10.48,47.81 10.48,46.68 8.91,45.1 7.77,45.1 7.05,44.39 7.05,42.05 6.07,41.05 4.89,41.05 BUTTONS.3
  Bottom 0.406: R13.1 4.89,41.05 BUTTONS.3
N$20
  Top 0.406: JP1.6 | JP1.6 JP1.4 JP1.2 | R15.1 25.41,40.79 STOP.1 27.38,42.75 JP1.6
N$21
  Top 0.406: R17.2 9.7,31.8 10.61,32.71 18.66,32.71 19.84,33.9 19.84,41.43 R16.2 19.84,44.94 JP1.12 JP1.10 JP1.8
N$22
  Top 0.406: Q1.B 6.83,18.44 R18.2 3.3,18.44 OPT_SENSOR.1
N$23
  Top 0.406: Q1.C 7.78,27.28 R12.2 9.59,27.34 R17.1
N$24
  Bottom 0.406: JP1.7 26.23,48.95 RASPBERRY_PI_GPIO.15
N$25
  Bottom 0.406: JP1.5 29.63,49.82 42.8,49.82 RASPBERRY_PI_GPIO.29
N$26
  Bottom 0.406: JP1.3 31.32,48.96 48.31,48.96 49.13,49.78 49.13,50.98 RASPBERRY_PI_GPIO.33
N$27
  Bottom 0.406: JP1.1 50.63,47.56 51.77,48.7 51.77,50.88 RASPBERRY_PI_GPIO.35
N$29
  Bottom 1.27: POWER.1 30.09,4.42 D1.A
N$30  (1 unrouted)
  Top 0.254: 62.39,55.9 arc-93 64.95,52.91
  Bottom 0.254: 62.38,55.9 arc-93 64.94,52.91
N$31  (1 unrouted)
  Top 0.254: 2.76,55.81 arc83 0.26,53.69
  Bottom 0.254: 2.68,55.88 arc83 0.29,53.71
N$32  (1 unrouted)
  Top 0.254: 61.94,0.09 arc99 64.98,2.83
  Bottom 0.254: 61.92,0.07 arc99 64.95,2.82
N$33  (1 unrouted)
  Top 0.254: 0.09,2.97 arc91 2.71,0.08
  Bottom 0.254: 0.08,2.97 arc91 2.71,0.08
N$34
  cutout Top: 49.37,40.21 55.58,40.21 55.58,23.8 48.9,23.8 48.9,40.25 49.47,40.25
VALVE1_1
  Top 0.406: IC4.11 13.33,21.74 VALVE1.1
VALVE1_2
  Top 0.406: IC4.12 15.1,20.47 VALVE1.2
VALVE1_3
  Top 0.406: IC4.13 13.33,19.2 VALVE1.3
VALVE1_4
  Top 0.406: IC4.14 15.1,17.93 VALVE1.4
VALVE1_5
  Top 0.406: IC4.15 13.33,16.66 VALVE1.5
VALVE1_6
  Top 0.406: IC4.16 15.1,15.39 VALVE1.6
VALVE1_7
  Top 0.406: IC4.17 13.33,14.12 VALVE1.7
VALVE1_8
  Top 0.406: IC4.18 15.1,12.85 VALVE1.8
VALVE2_1
  Top 0.406: IC5.18 59.11,21.68 VALVE2.1
VALVE2_2
  Top 0.406: IC5.17 60.38,20.41 VALVE2.2
VALVE2_3
  Top 0.406: IC5.16 59.11,19.14 VALVE2.3
VALVE2_4
  Top 0.406: IC5.15 60.38,17.87 VALVE2.4
VALVE2_5
  Top 0.406: IC5.14 56.2,16.6 56.29,16.51 59.02,16.51 VALVE2.5
VALVE2_6
  Top 0.406: IC5.13 60.38,15.33 VALVE2.6
VALVE2_7
  Top 0.406: IC5.12 59.11,14.06 VALVE2.7
VALVE2_8
  Top 0.406: IC5.11 60.38,12.79 VALVE2.8
VALVE3_1
  Bottom 0.406: IC6.18 55.68,23.84 55.69,23.85 60.54,23.85 VALVE3.1
VALVE3_2
  Bottom 0.406: IC6.17 55.6,25.11 55.69,25.03 59.17,25.03 VALVE3.2
VALVE3_3
  Bottom 0.406: IC6.16 55.69,26.38 | 55.69,26.38 | 55.69,26.38 60.53,26.38 VALVE3.3
VALVE3_4
  Bottom 0.406: IC6.15 55.71,27.65 55.72,27.67 59.19,27.67 VALVE3.4
VALVE3_5
  Bottom 0.406: IC6.14 60.53,28.92 VALVE3.5
VALVE3_6
  Bottom 0.406: IC6.13 59.2,30.19 VALVE3.6
VALVE3_7
  Bottom 0.406: IC6.12 60.53,31.46 VALVE3.7
VALVE3_8
  Bottom 0.406: IC6.11 59.2,32.73 VALVE3.8
VALVE4_1
  Bottom 0.406: VALVE4.1 14.96,23.82 IC7.11
VALVE4_2
  Bottom 0.406: VALVE4.2 13.71,25.09 IC7.12
VALVE4_3
  Bottom 0.406: VALVE4.3 14.98,26.36 IC7.13
VALVE4_4
  Bottom 0.406: VALVE4.4 13.71,27.63 IC7.14
VALVE4_5
  Bottom 0.406: VALVE4.5 14.98,28.9 IC7.15
VALVE4_6
  Bottom 0.406: VALVE4.6 13.71,30.17 IC7.16
VALVE4_7
  Bottom 0.406: VALVE4.7 14.98,31.44 IC7.17
VALVE4_8
  Bottom 0.406: VALVE4.8 13.71,32.71 IC7.18

### Text on the board
Top: rpi2caster / v1.0-beta1 | TOP
Bottom: BOTTOM